# Altium schematic sheet 红外反射LM393.SchDoc
size A4
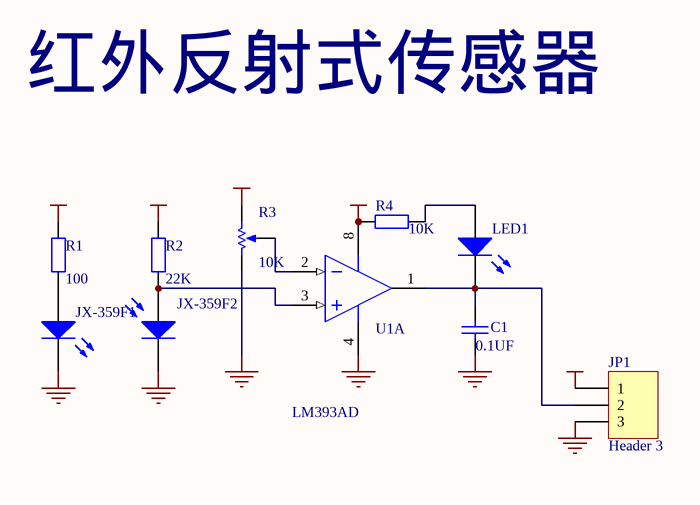
[diagram p0: 红外反射LM393.SchDoc]

## Parts
C1  value 0.1UF  [C1608-0603]
JP1  Header 3  [HDR1X3]
JX-359F1  (no value)  [HDR1X2]
JX-359F2  (no value)  [HDR1X2]
LED1  (no value)  [HDR1X2]
R1  value 100  [C1608-0603]
R2  value 22K  [C1608-0603]
R3  value 10K  [HDR1X3]
R4  value 10K  [C1608-0603]
U1  LM393AD  [SO8]  (part A of 2)

## Nets
GND: C1.1 JP1.3 JX-359F1.2(K) JX-359F2.2(K) R3.2(BOT) U1.4(V-)
VCC: JP1.1 R1.2 R2.2 R3.1(TOP) R4.2 U1.8(V+)
NetC1_2: C1.2 JP1.2 LED1.2(K) U1.1(OUT)
NetJX-359F1_1: JX-359F1.1(A) R1.1
NetJX-359F2_1: JX-359F2.1(A) R2.1 U1.3(IN+)
NetLED1_1: LED1.1(A) R4.1
NetR3_3: R3.3(TAP) U1.2(IN-)

## Notes on the sheet
- 红外反射式传感器

## Library data of the parts
C1 = Cap Semi: Capacitor (Semiconductor SIM Model); Published: 8-Jun-2000; LatestRevisionDate: 17-Jul-2002; LatestRevisionNote: Re-released for DXP Platform.; PackageReference: C1206; Publisher: Altium Limited
JP1 = Header 3: Header, 3-Pin; LatestRevisionDate: 17-Jul-2002; LatestRevisionNote: Re-released for DXP Platform.; Publisher: Altium Limited
JX-359F1 LED1 = LED3: Typical BLUE SiC LED; Published: 8-Jun-2000; LatestRevisionDate: 17-Dec-2003; LatestRevisionNote: PCB Footprint replaced.; Publisher: Altium Limited
JX-359F2 = Photo Sen: Photosensitive Diode; Published: 24-Mar-1999; LatestRevisionDate: 17-Jul-2002; LatestRevisionNote: Re-released for DXP Platform.; Publisher: Altium Limited
R1 R2 R4 = Res2: Resistor; Published: 8-Jun-2000; LatestRevisionDate: 17-Jul-2002; LatestRevisionNote: Re-released for DXP Platform.; Publisher: Altium Limited
R3 = RPot: Potentiometer; Sim Note: Enter the Resistance value and the set point into parameter fields.; Set Position: 0.5; Published: 8-Jun-2000; LatestRevisionDate: 17-Jul-2002; LatestRevisionNote: Re-released for DXP Platform.; Publisher: Altium Limited
U1 = LM393AD: Low-Power Dual Voltage Comparator; Published: 24-Aug-2001; LatestRevisionDate: 6-Jun-2005; LatestRevisionNote: Stylized 3D Model Added.; DatasheetDocument: Nov-1992; PackageDocument: Jul-1998; PackageReference: SO8; Publisher: Altium Limited; Code_JEDEC: MS-012-AA; Code_IPC: SO8; ComponentLink1Description: Manufacturer Link; ComponentLink1URL: http://www.st.com/